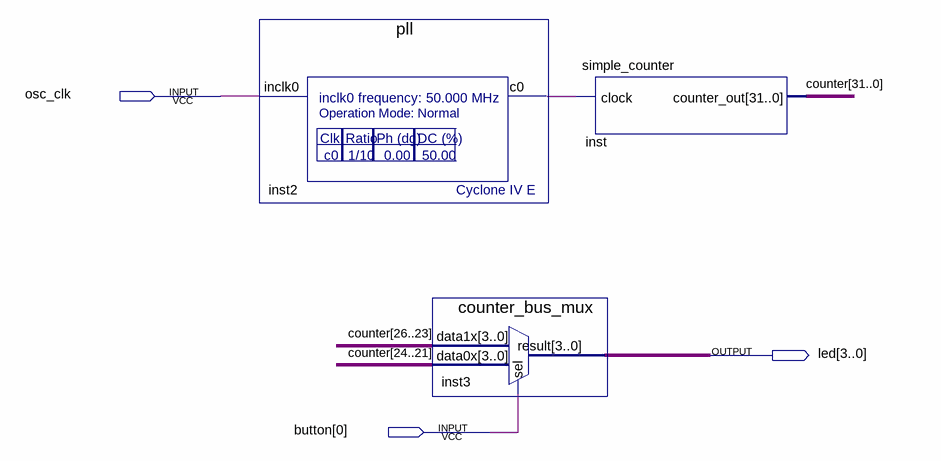
[diagram p0: schematic sheet]
// Quartus schematic tut0_top.bdf as structural Verilog: 3 symbols, 3 pins
module tut0_top (
  input  osc_clk,
  input  [0:0] button,
  output [3:0] led
);

  wire inst2_c0;
  wire [31:0] counter;

  pll inst2 (.inclk0(osc_clk), .c0(inst2_c0));
  counter_bus_mux inst3 (.data1x(counter[26:23]), .data0x(counter[24:21]), .sel(button[0]), .result(led));
  simple_counter inst (.clock(inst2_c0), .counter_out(counter));
endmodule
